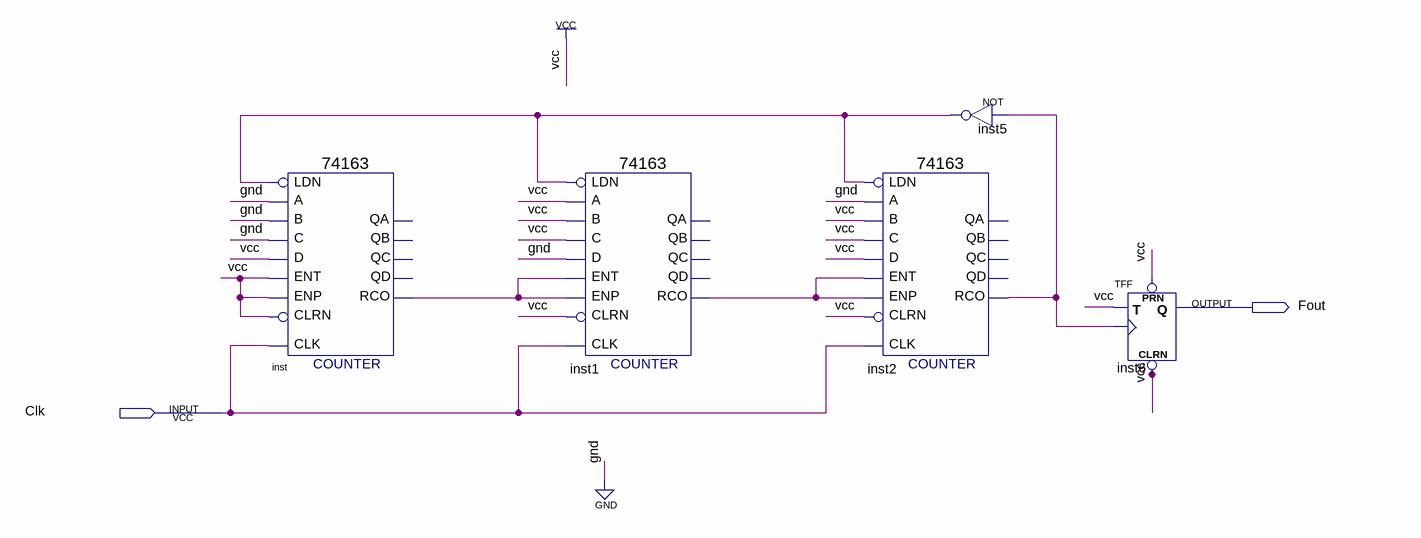
[diagram p0: schematic sheet]
// Quartus schematic freqdiv.bdf as structural Verilog: 5 symbols, 2 pins
module freqdiv (
  input  Clk,
  output Fout
);

  wire inst1_rco, inst2_rco, inst5_out, inst_rco;

  \74163  inst (
    .C(1'b0), .B(1'b0), .A(1'b0), .ENT(1'b1), .D(1'b1), .CLRN(1'b1), .CLK(Clk), .ENP(1'b1), .LDN(inst5_out),
    .RCO(inst_rco));  // open: QA, QB, QC, QD
  \74163  inst1 (
    .C(1'b1), .B(1'b1), .A(1'b1), .ENT(inst_rco), .D(1'b0), .CLRN(1'b1), .CLK(Clk), .ENP(inst_rco),
    .LDN(inst5_out), .RCO(inst1_rco));  // open: QA, QB, QC, QD
  \74163  inst2 (
    .C(1'b1), .B(1'b1), .A(1'b0), .ENT(inst1_rco), .D(1'b1), .CLRN(1'b1), .CLK(Clk), .ENP(inst1_rco),
    .LDN(inst5_out), .RCO(inst2_rco));  // open: QA, QB, QC, QD
  not inst5 (inst5_out, inst2_rco);
  TFF inst6 (.PRN(1'b1), .CLRN(1'b1), .T(1'b1), .CLK(inst2_rco), .Q(Fout));
endmodule
